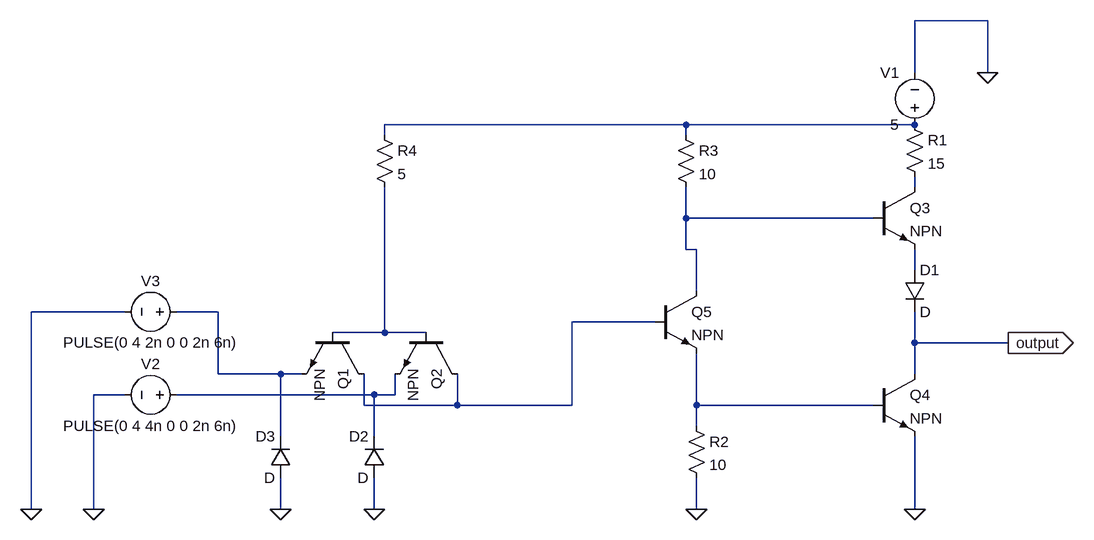
[diagram p0: schematic nand-tr-bi.asc]
nand-tr-bi.asc, the LTspice schematic file:
Version 4.1
SHEET 1 880 724
WIRE 336 -48 224 -48
WIRE 224 32 224 -48
WIRE 336 32 336 -48
WIRE -128 112 -592 112
WIRE 224 112 -128 112
WIRE -592 128 -592 112
WIRE -128 128 -128 112
WIRE 224 208 224 192
WIRE -128 256 -128 208
WIRE 160 256 -128 256
WIRE -128 304 -128 256
WIRE -112 304 -128 304
WIRE 224 336 224 304
WIRE -112 368 -112 304
WIRE -992 400 -1136 400
WIRE -848 400 -912 400
WIRE -176 416 -304 416
WIRE -592 432 -592 208
WIRE -592 432 -672 432
WIRE -528 432 -592 432
WIRE 224 448 224 400
WIRE 368 448 224 448
WIRE -848 496 -848 400
WIRE -752 496 -848 496
WIRE -720 496 -752 496
WIRE 224 496 224 448
WIRE -992 528 -1040 528
WIRE -608 528 -912 528
WIRE -576 528 -576 496
WIRE -576 528 -608 528
WIRE -624 544 -624 496
WIRE -480 544 -480 496
WIRE -480 544 -624 544
WIRE -304 544 -304 416
WIRE -304 544 -480 544
WIRE -112 544 -112 464
WIRE 160 544 -112 544
WIRE -112 576 -112 544
WIRE -752 592 -752 496
WIRE -608 592 -608 528
WIRE -1136 704 -1136 400
WIRE -1040 704 -1040 528
WIRE -752 704 -752 656
WIRE -608 704 -608 656
WIRE -112 704 -112 656
WIRE 224 704 224 592
FLAG 336 32 0
FLAG 224 704 0
FLAG -112 704 0
FLAG -608 704 0
FLAG -752 704 0
FLAG -1040 704 0
FLAG -1136 704 0
FLAG 368 448 output
IOPIN 368 448 Out
SYMBOL voltage 224 128 R180
WINDOW 0 24 96 Left 2
WINDOW 3 24 16 Left 2
WINDOW 123 0 0 Left 0
WINDOW 39 0 0 Left 0
SYMATTR InstName V1
SYMATTR Value 5
SYMBOL npn -624 432 R90
SYMATTR InstName Q1
SYMBOL npn -480 432 R90
SYMATTR InstName Q2
SYMBOL npn 160 208 R0
SYMATTR InstName Q3
SYMBOL npn 160 496 R0
SYMATTR InstName Q4
SYMBOL npn -176 368 R0
SYMATTR InstName Q5
SYMBOL res 208 96 R0
SYMATTR InstName R1
SYMATTR Value 15
SYMBOL res -128 560 R0
SYMATTR InstName R2
SYMATTR Value 10
SYMBOL res -144 112 R0
SYMATTR InstName R3
SYMATTR Value 10
SYMBOL res -608 112 R0
SYMATTR InstName R4
SYMATTR Value 5
SYMBOL diode 208 336 R0
SYMATTR InstName D1
SYMBOL diode -592 656 R180
WINDOW 0 24 64 Left 2
WINDOW 3 24 0 Left 2
SYMATTR InstName D2
SYMBOL diode -736 656 R180
WINDOW 0 24 64 Left 2
WINDOW 3 24 0 Left 2
SYMATTR InstName D3
SYMBOL voltage -896 528 R90
WINDOW 0 -32 56 VBottom 2
WINDOW 3 32 56 VTop 2
WINDOW 123 0 0 Left 0
WINDOW 39 0 0 Left 0
SYMATTR InstName V2
SYMATTR Value PULSE(0 4 4n 0 0 2n 6n)
SYMBOL voltage -896 400 R90
WINDOW 0 -32 56 VBottom 2
WINDOW 3 32 56 VTop 2
WINDOW 123 0 0 Left 0
WINDOW 39 0 0 Left 0
SYMATTR InstName V3
SYMATTR Value PULSE(0 4 2n 0 0 2n 6n)

The netlist it stands for:
* nand-tr-bi.asc
V1 N001 0 5
Q1 N006 N007 N005 0 NPN
Q2 N006 N007 N008 0 NPN
Q3 N002 N003 N004 0 NPN
Q4 output N009 0 0 NPN
Q5 N003 N006 N009 0 NPN
R1 N001 N002 15
R2 N009 0 10
R3 N001 N003 10
R4 N001 N007 5
D1 N004 output D
D2 0 N008 D
D3 0 N005 D
V2 N008 0 PULSE(0 4 4n 0 0 2n 6n)
V3 N005 0 PULSE(0 4 2n 0 0 2n 6n)
.model D D
.lib standard.dio
.model NPN NPN
.model PNP PNP
.lib standard.bjt
.backanno
.end